# Altium schematic sheet JTag2SWD.SchDoc
size A
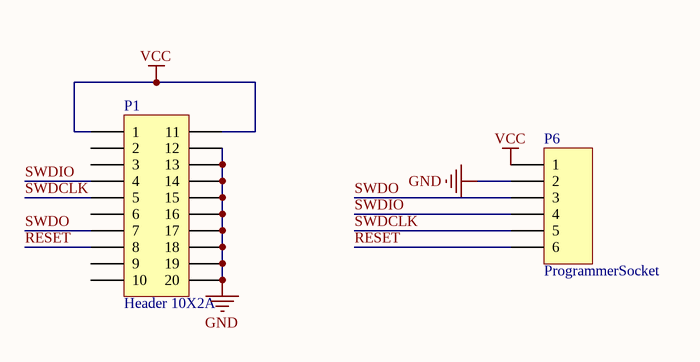
[diagram p0: JTag2SWD.SchDoc]

## Parts
P1  Header 10X2A  [HDR2X10_CEN]
P6  ProgrammerSocket  [HDR1X6]

## Nets
GND: P1.12 P1.13 P1.14 P1.15 P1.16 P1.17 P1.18 P1.19 P1.20 P6.2
VCC: P1.1 P1.11 P6.1
RESET: P1.8 P6.6
SWDCLK: P1.5 P6.5
SWDIO: P1.4 P6.4
SWDO: P1.7 P6.3

Not connected (* = marked no-connect by the designer): P1 2 3 6 9 10

## Library data of the parts
P1 = Header 10X2A: Header, 10-Pin, Dual row; LatestRevisionDate: 17-Jul-2002; LatestRevisionNote: Re-released for DXP Platform.; Publisher: Altium Limited
P6 = Header 6: Header, 6-Pin; LatestRevisionDate: 17-Jul-2002; LatestRevisionNote: Re-released for DXP Platform.; Publisher: Altium Limited